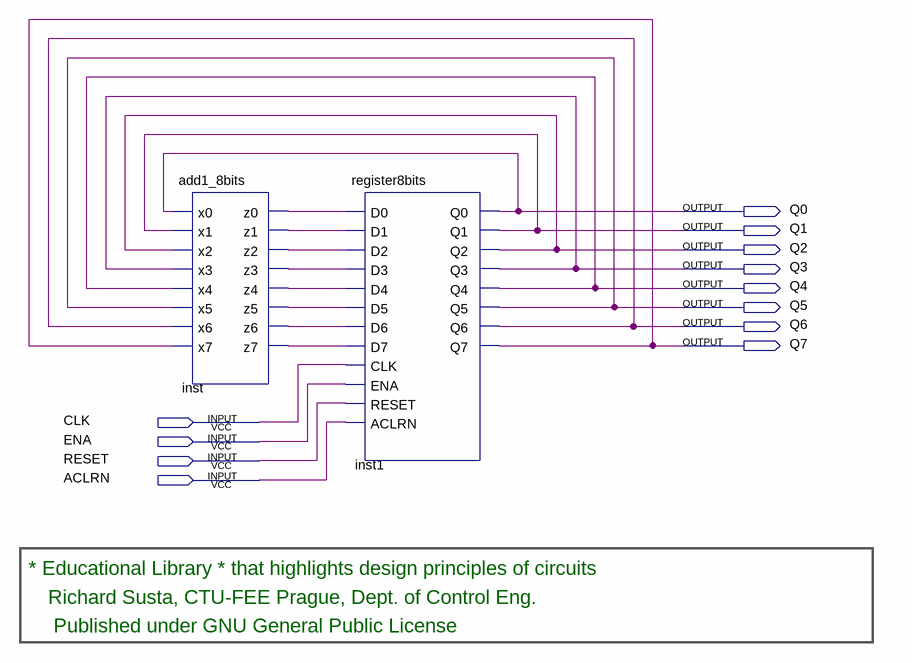
[diagram p0: schematic sheet]
// Quartus schematic counter8bits.bdf as structural Verilog: 2 symbols, 12 pins
module counter8bits (
  input  CLK,
  input  ENA,
  input  RESET,
  input  ACLRN,
  output Q0,
  output Q1,
  output Q2,
  output Q3,
  output Q4,
  output Q5,
  output Q6,
  output Q7
);

  wire inst_z0, inst_z1, inst_z2, inst_z3, inst_z4, inst_z5, inst_z6, inst_z7;

  add1_8bits inst (
    .x0(Q0), .x1(Q1), .x2(Q2), .x3(Q3), .x4(Q4), .x5(Q5), .x6(Q6), .x7(Q7), .z0(inst_z0), .z1(inst_z1),
    .z2(inst_z2), .z3(inst_z3), .z4(inst_z4), .z5(inst_z5), .z6(inst_z6), .z7(inst_z7));
  register8bits inst1 (
    .D0(inst_z0), .D1(inst_z1), .D2(inst_z2), .D3(inst_z3), .D4(inst_z4), .D5(inst_z5), .D6(inst_z6),
    .D7(inst_z7), .CLK(CLK), .ENA(ENA), .RESET(RESET), .ACLRN(ACLRN), .Q0(Q0), .Q1(Q1), .Q2(Q2), .Q3(Q3),
    .Q4(Q4), .Q5(Q5), .Q6(Q6), .Q7(Q7));

  // Notes on the sheet:
  //   * Educational Library * that highlights design principles of circuits
  //   Richard Susta, CTU-FEE Prague, Dept. of Control Eng. 
  //    Published under GNU General Public License
endmodule
